# EasyEDA schematic SCH_TFG.json

## Sheets
1 Buck: TITLE: Buck; REV: 1.0; Date: 2022-05-14; Sheet: 1/1; Drawn By: H. Bohe Navarrete; Company: EUSS
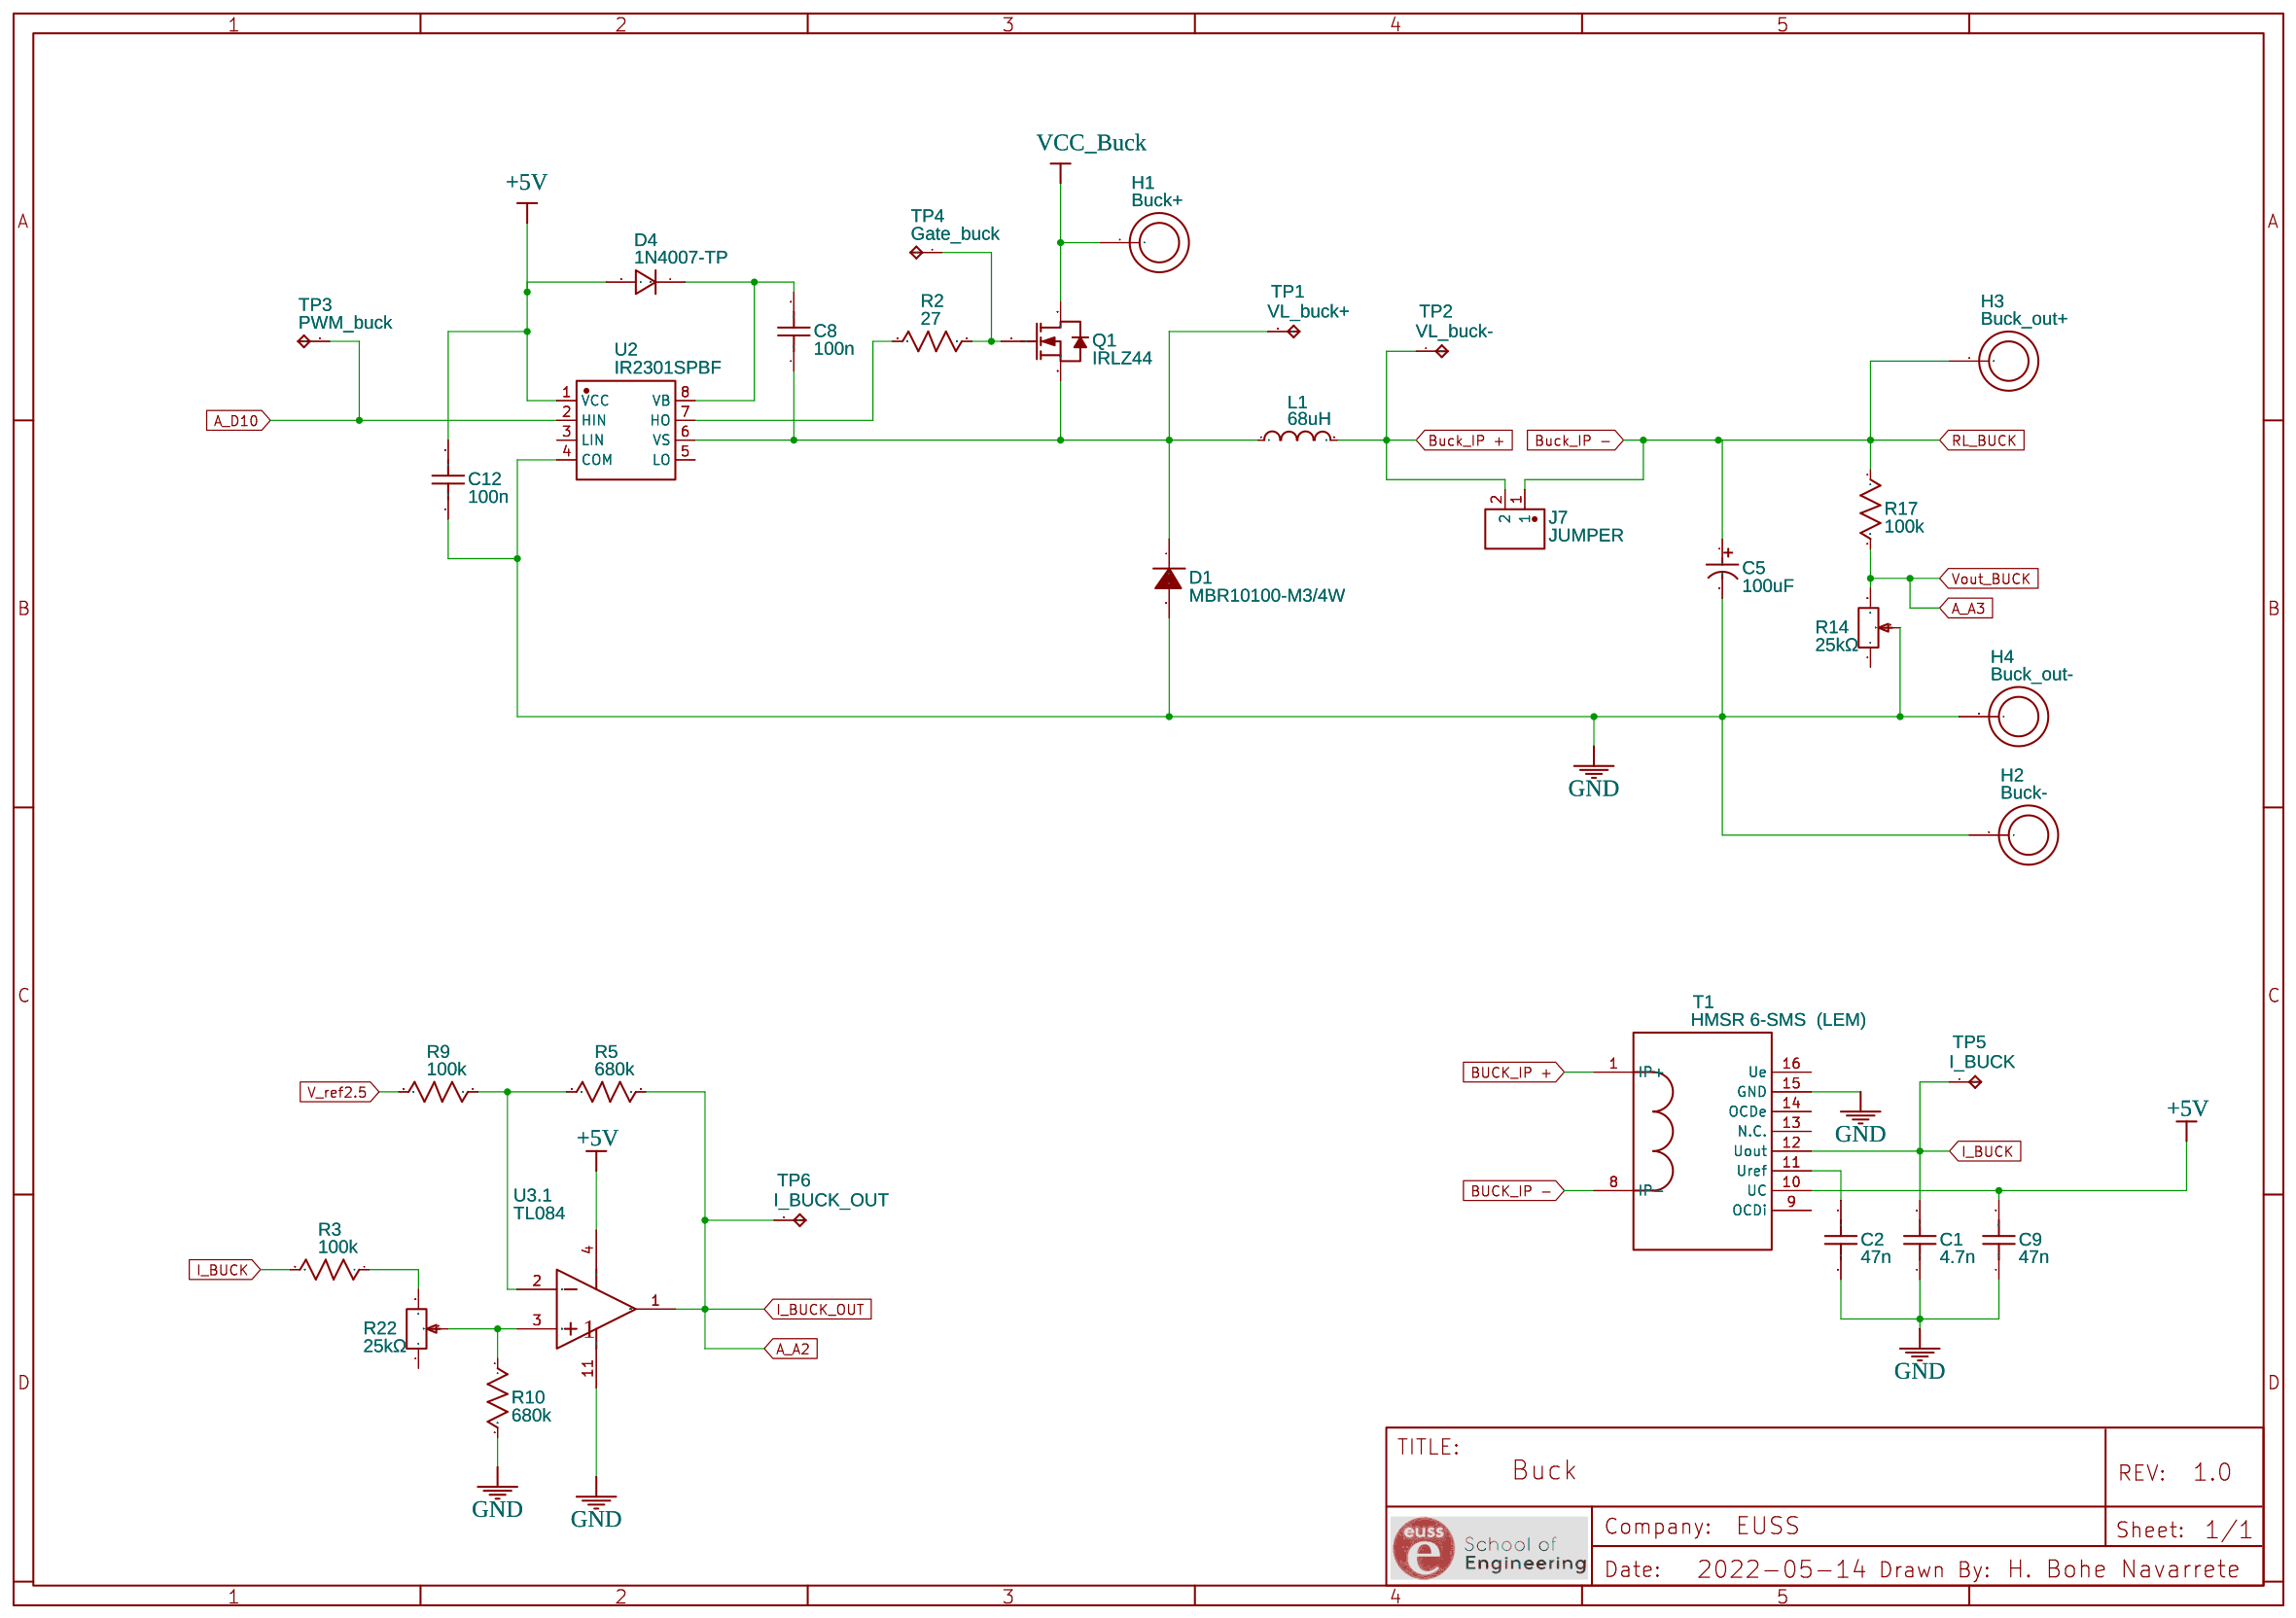
[diagram p0: Buck]
2 Boost copy: TITLE: Boost
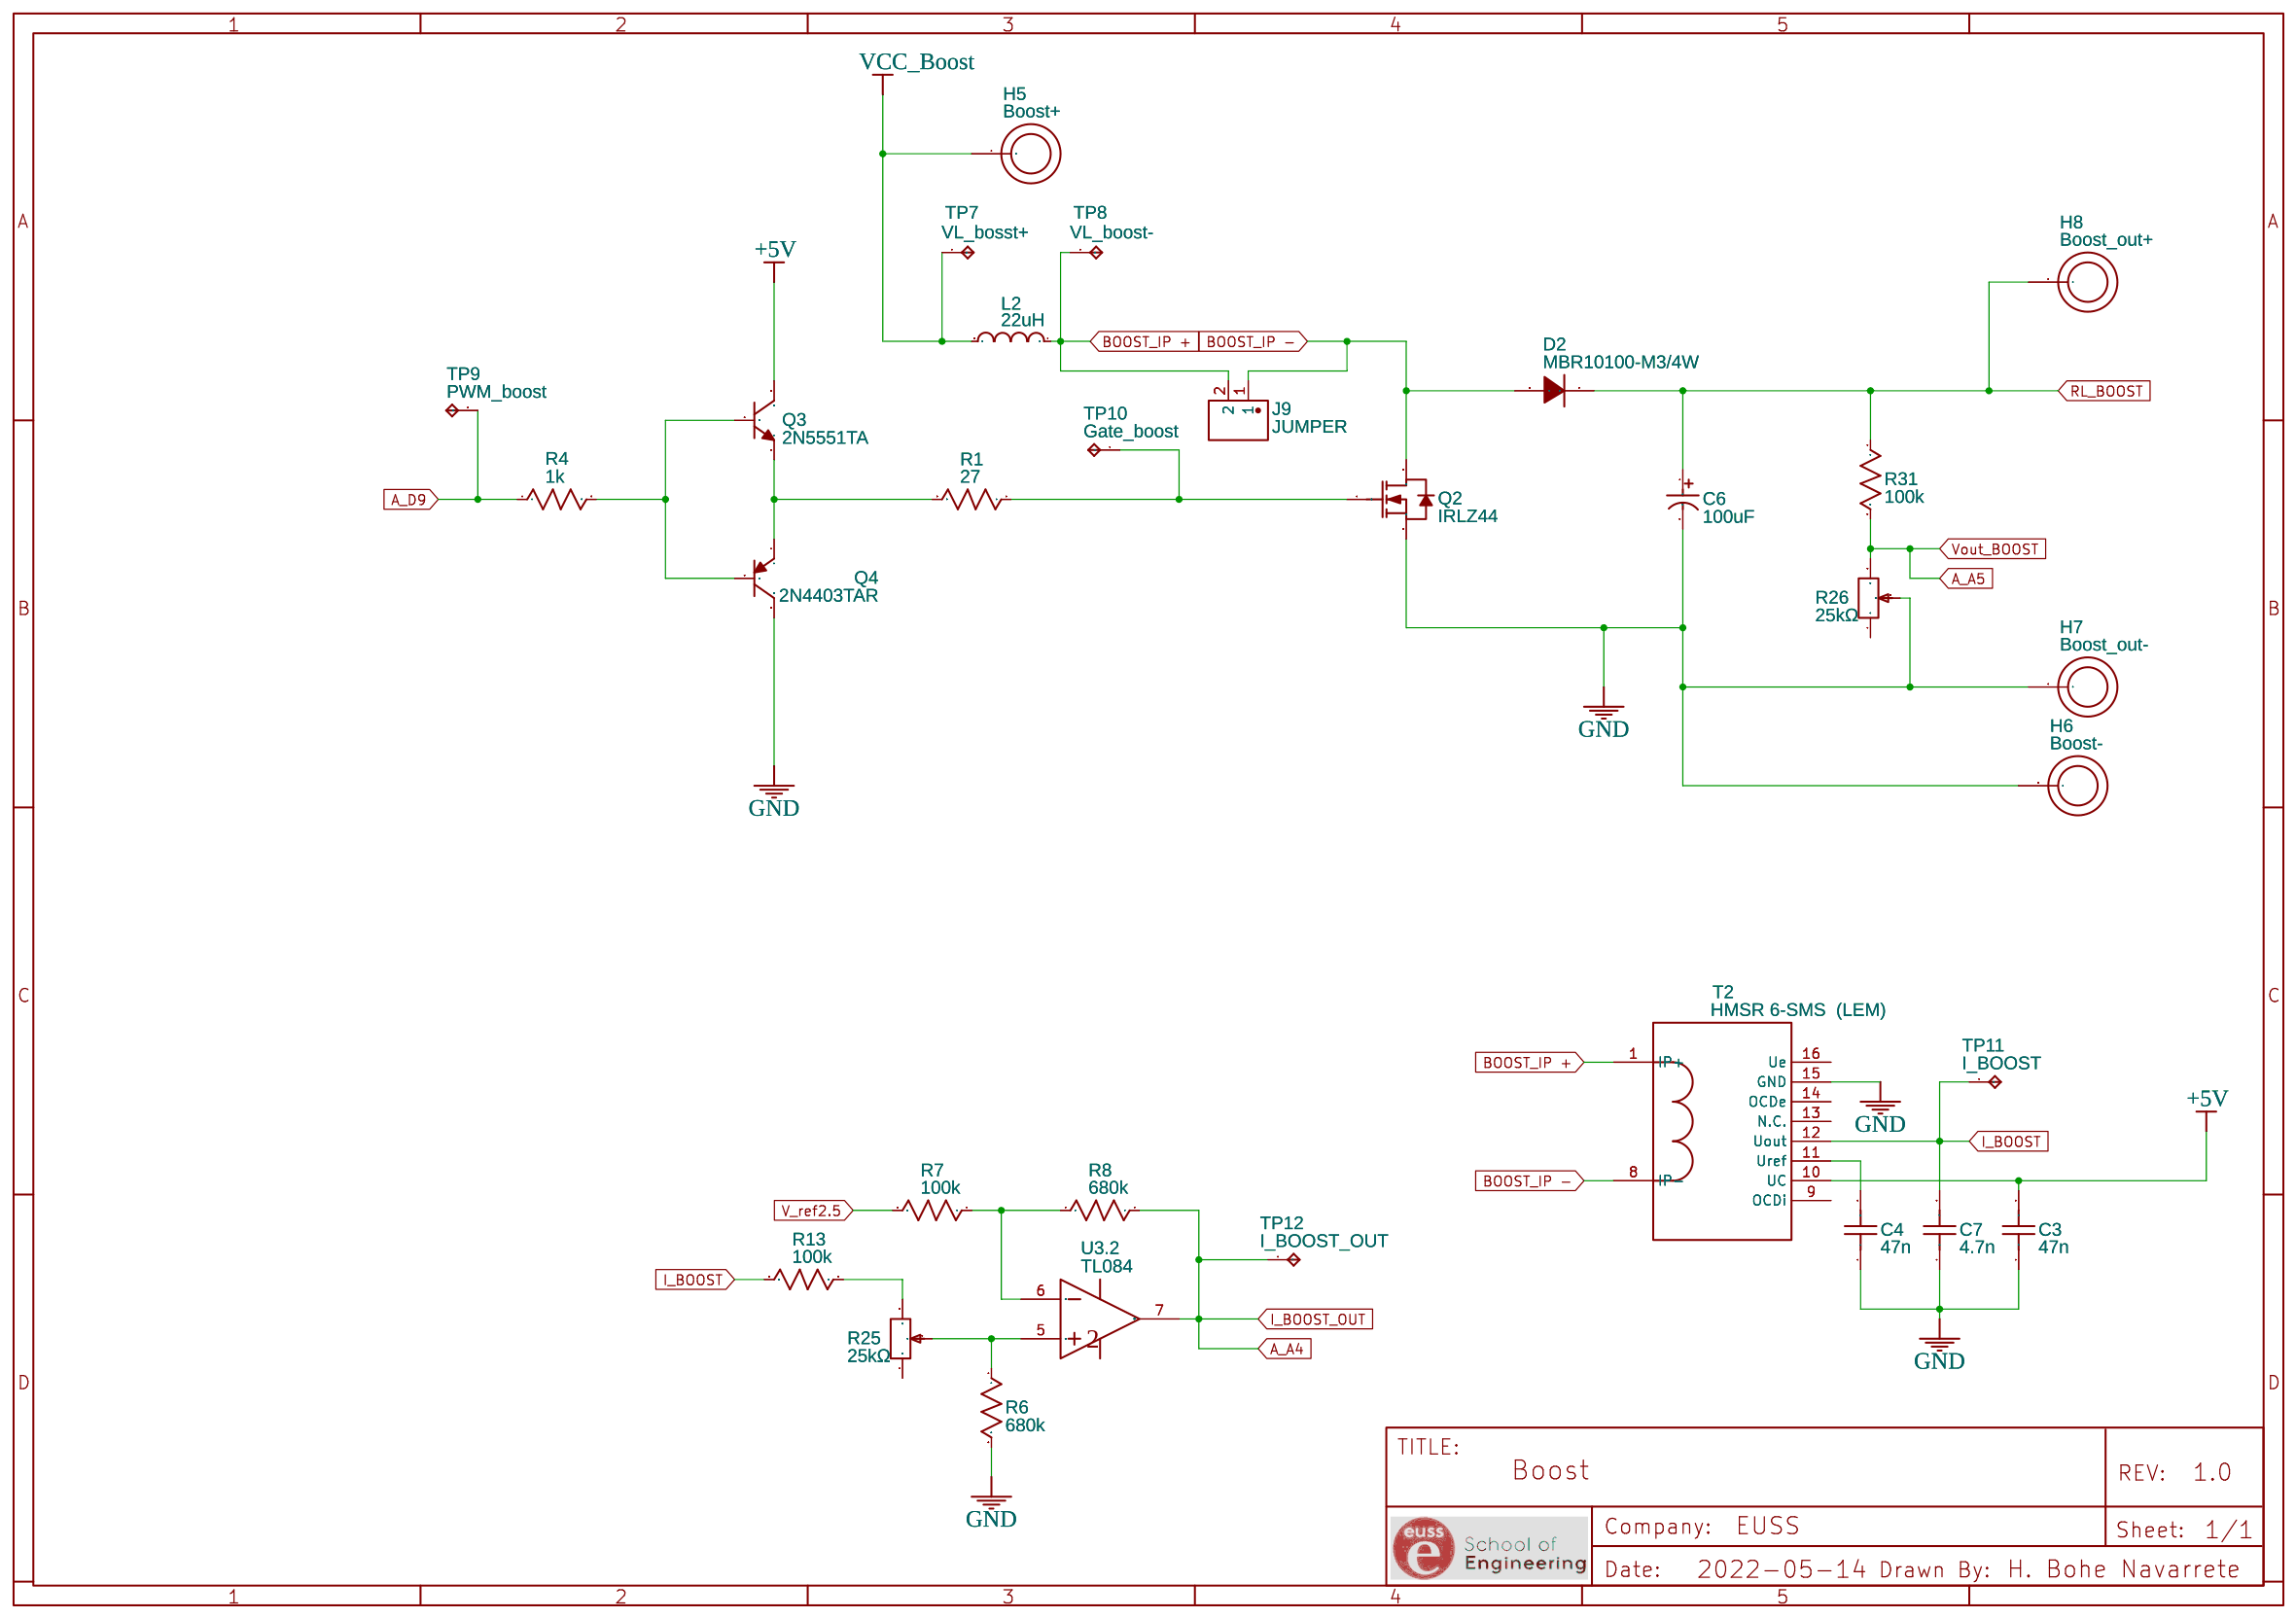
[diagram p1: Boost copy]
3 Arduino copy: TITLE: ARDUINO
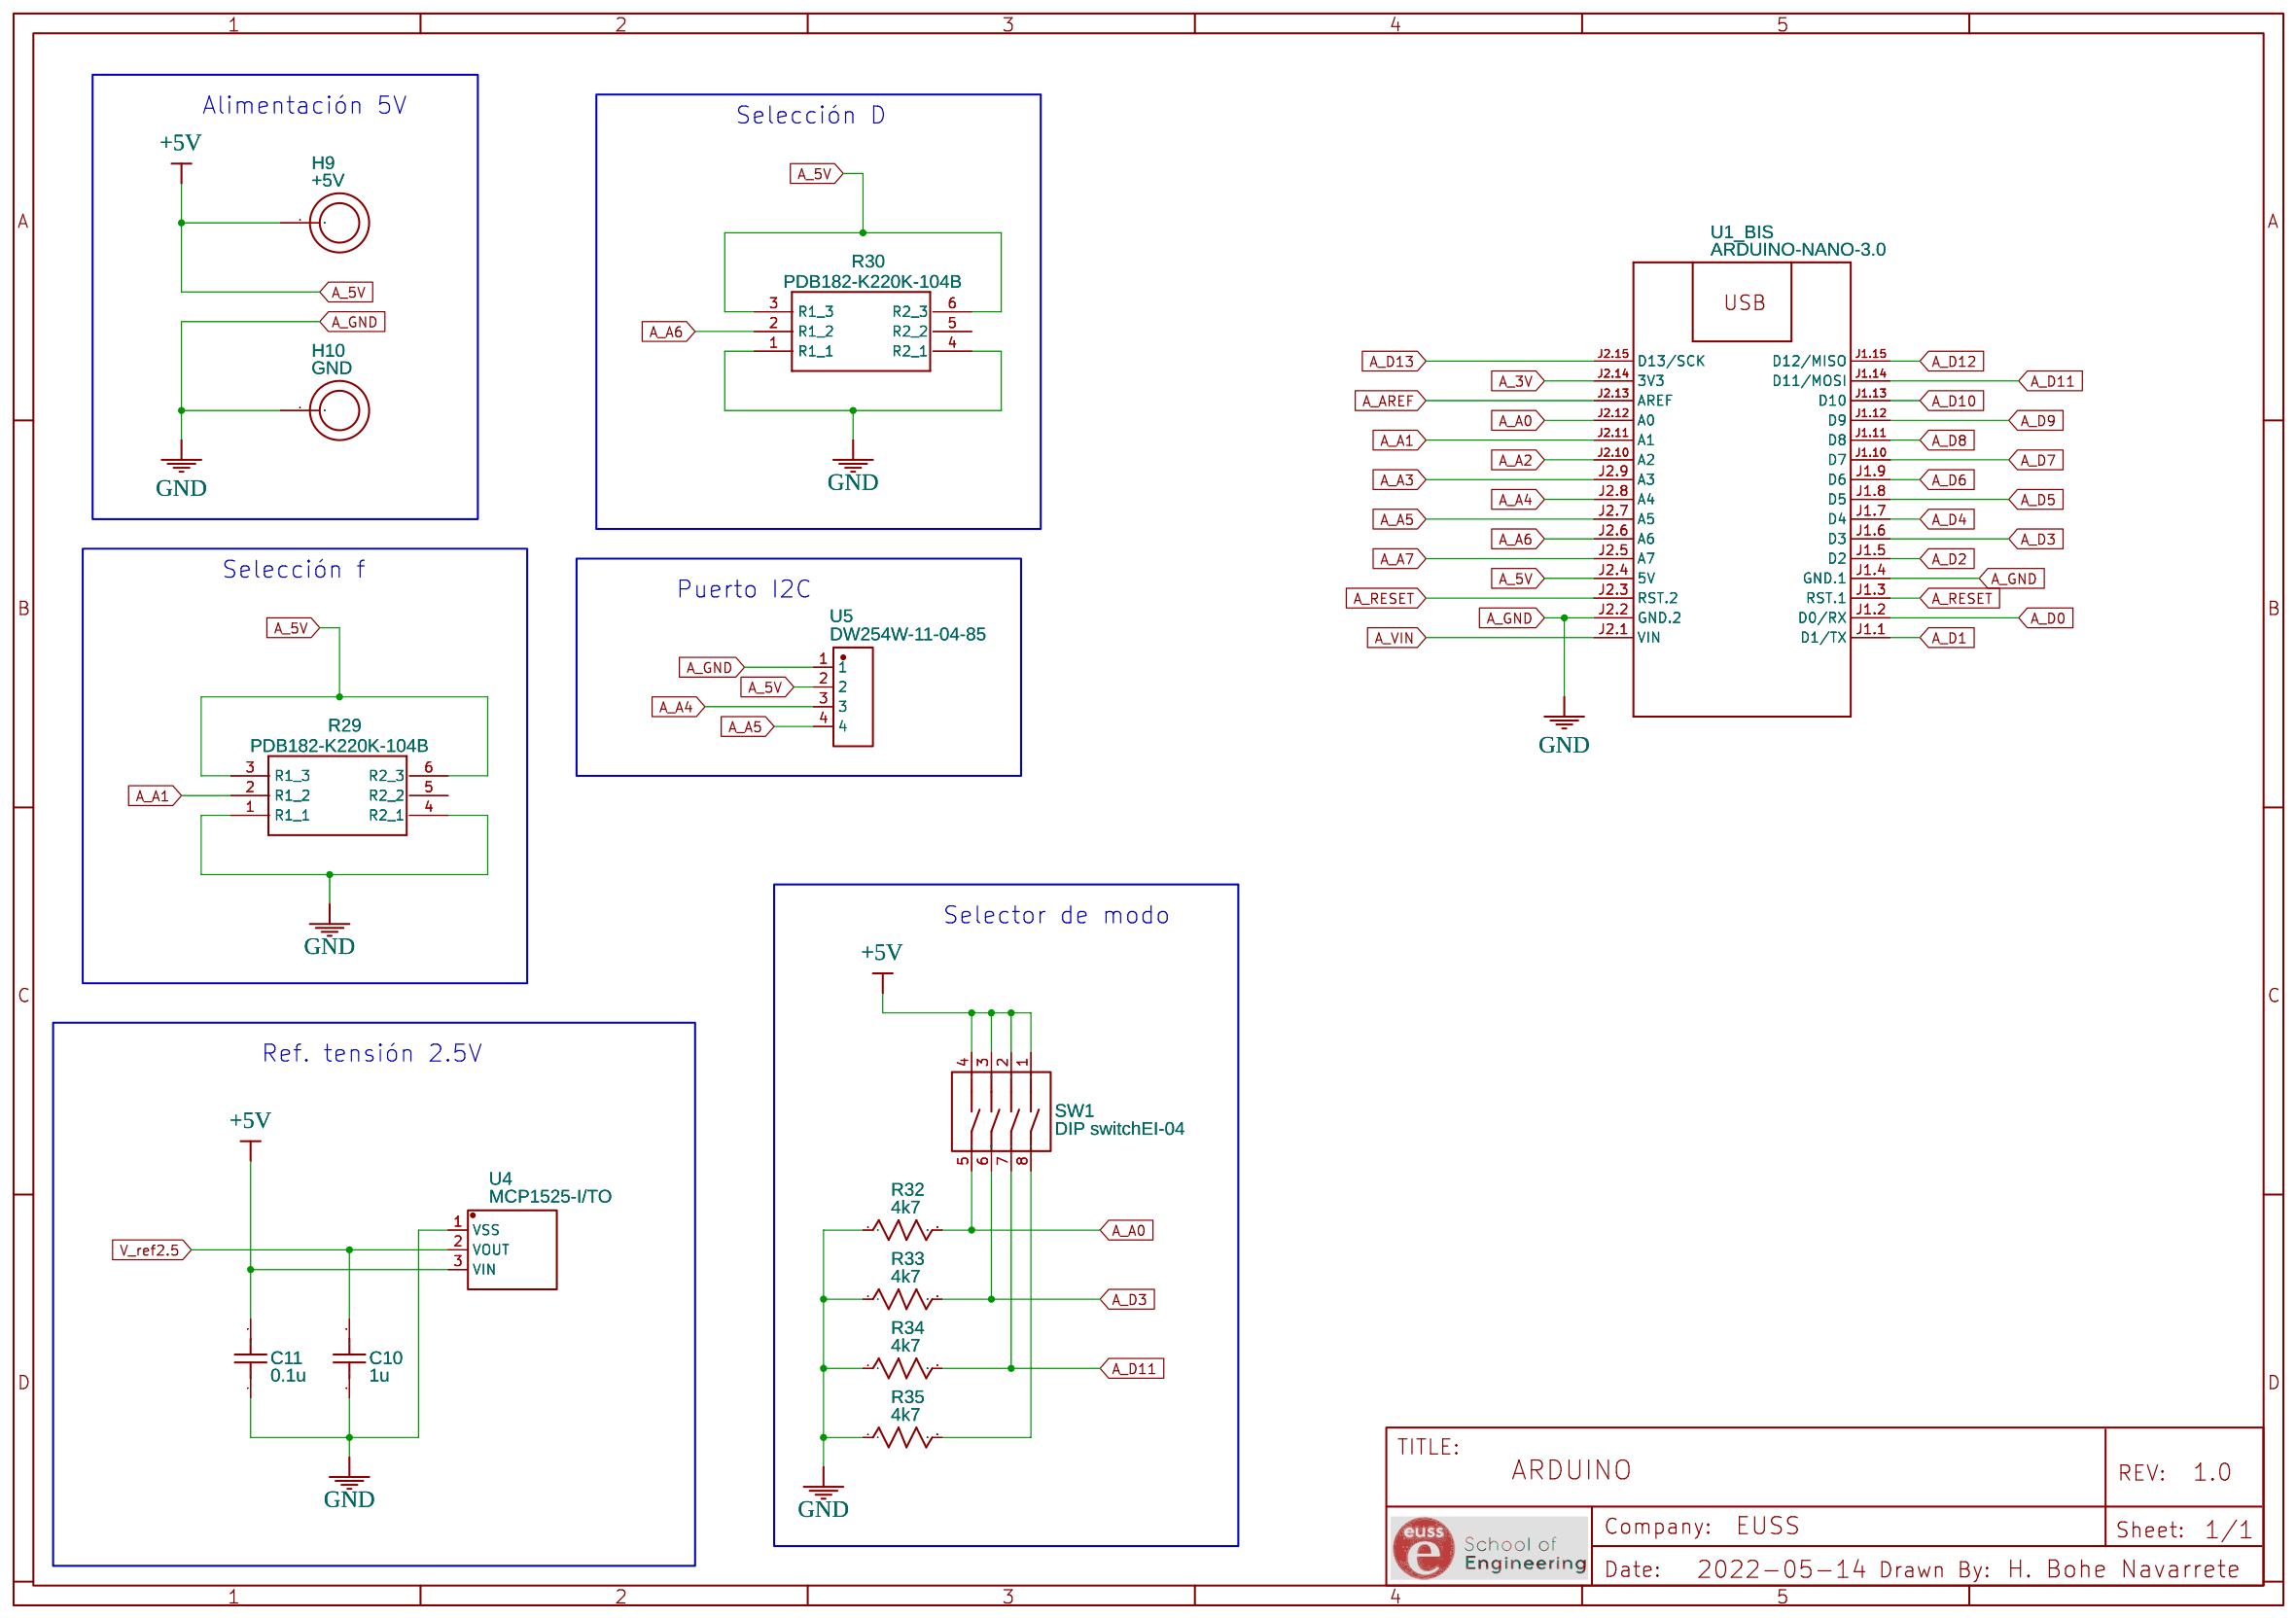
[diagram p2: Arduino copy]
4 Resitencias copy: TITLE: Resistencias
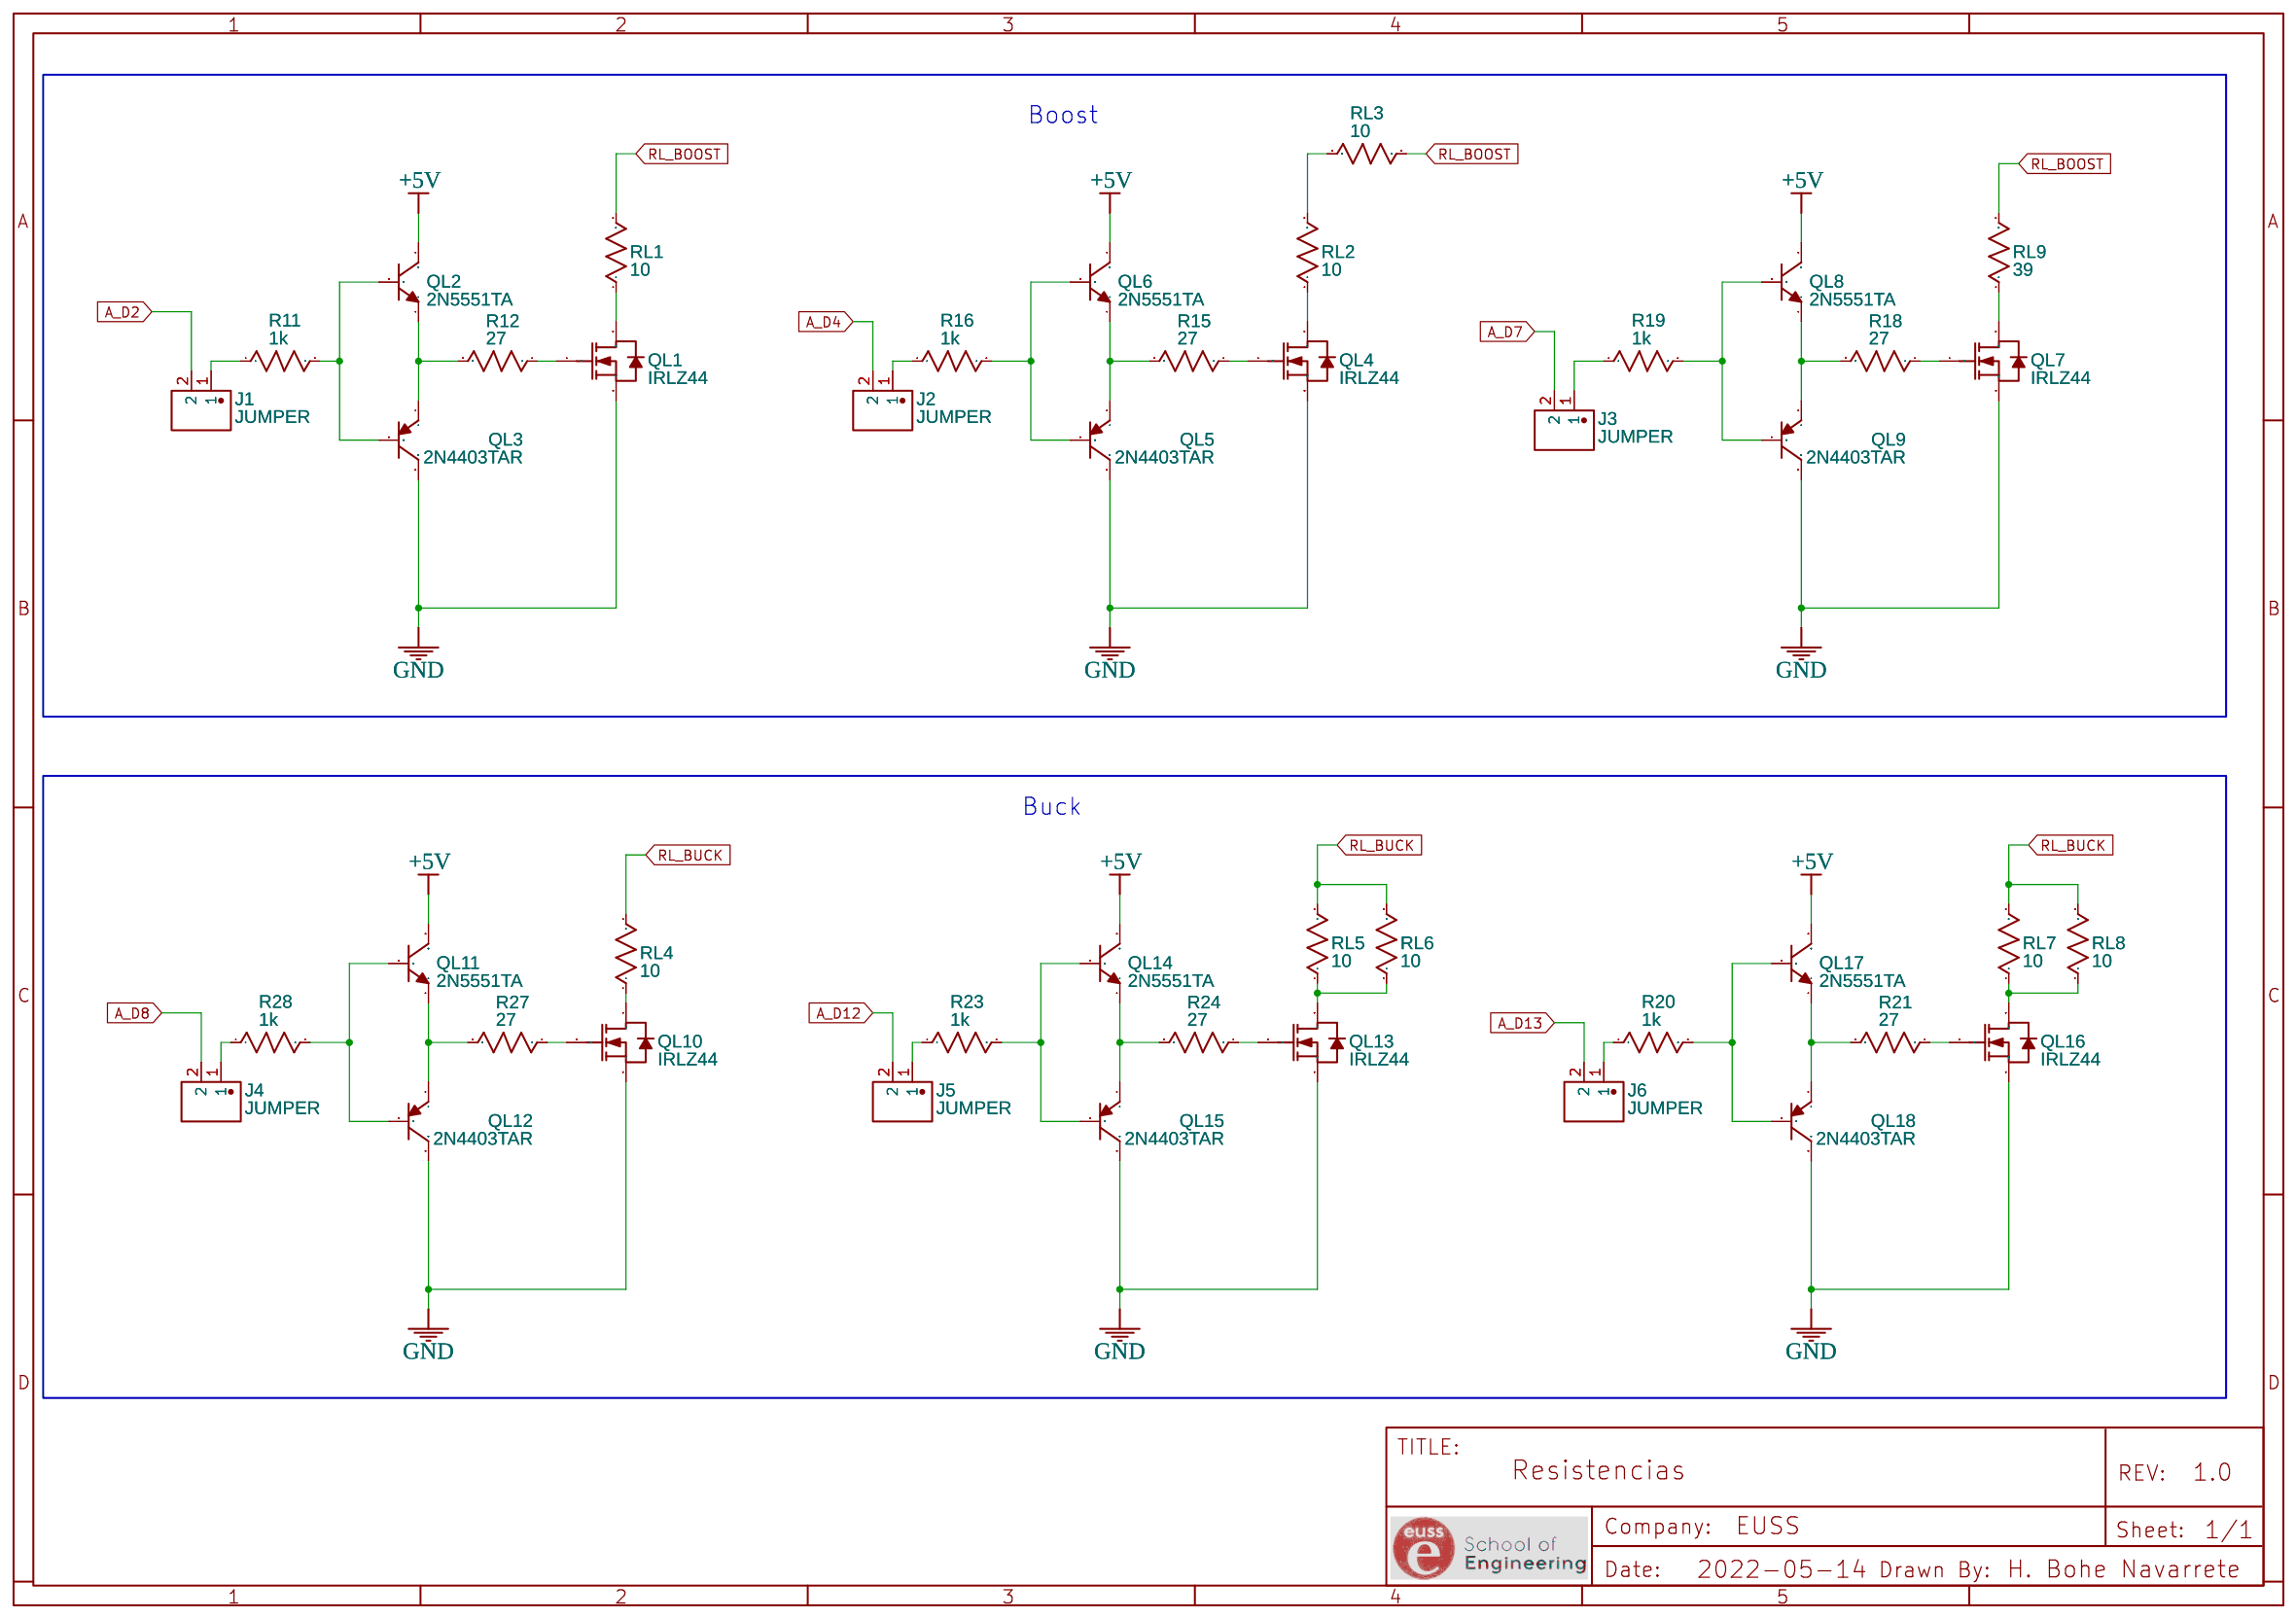
[diagram p3: Resitencias copy]
5 Sheet_1 copy: TITLE: Sheet_1; Date: 2022-06-09; Drawn By: Hector Bohe Navarrete; Company: Your Company
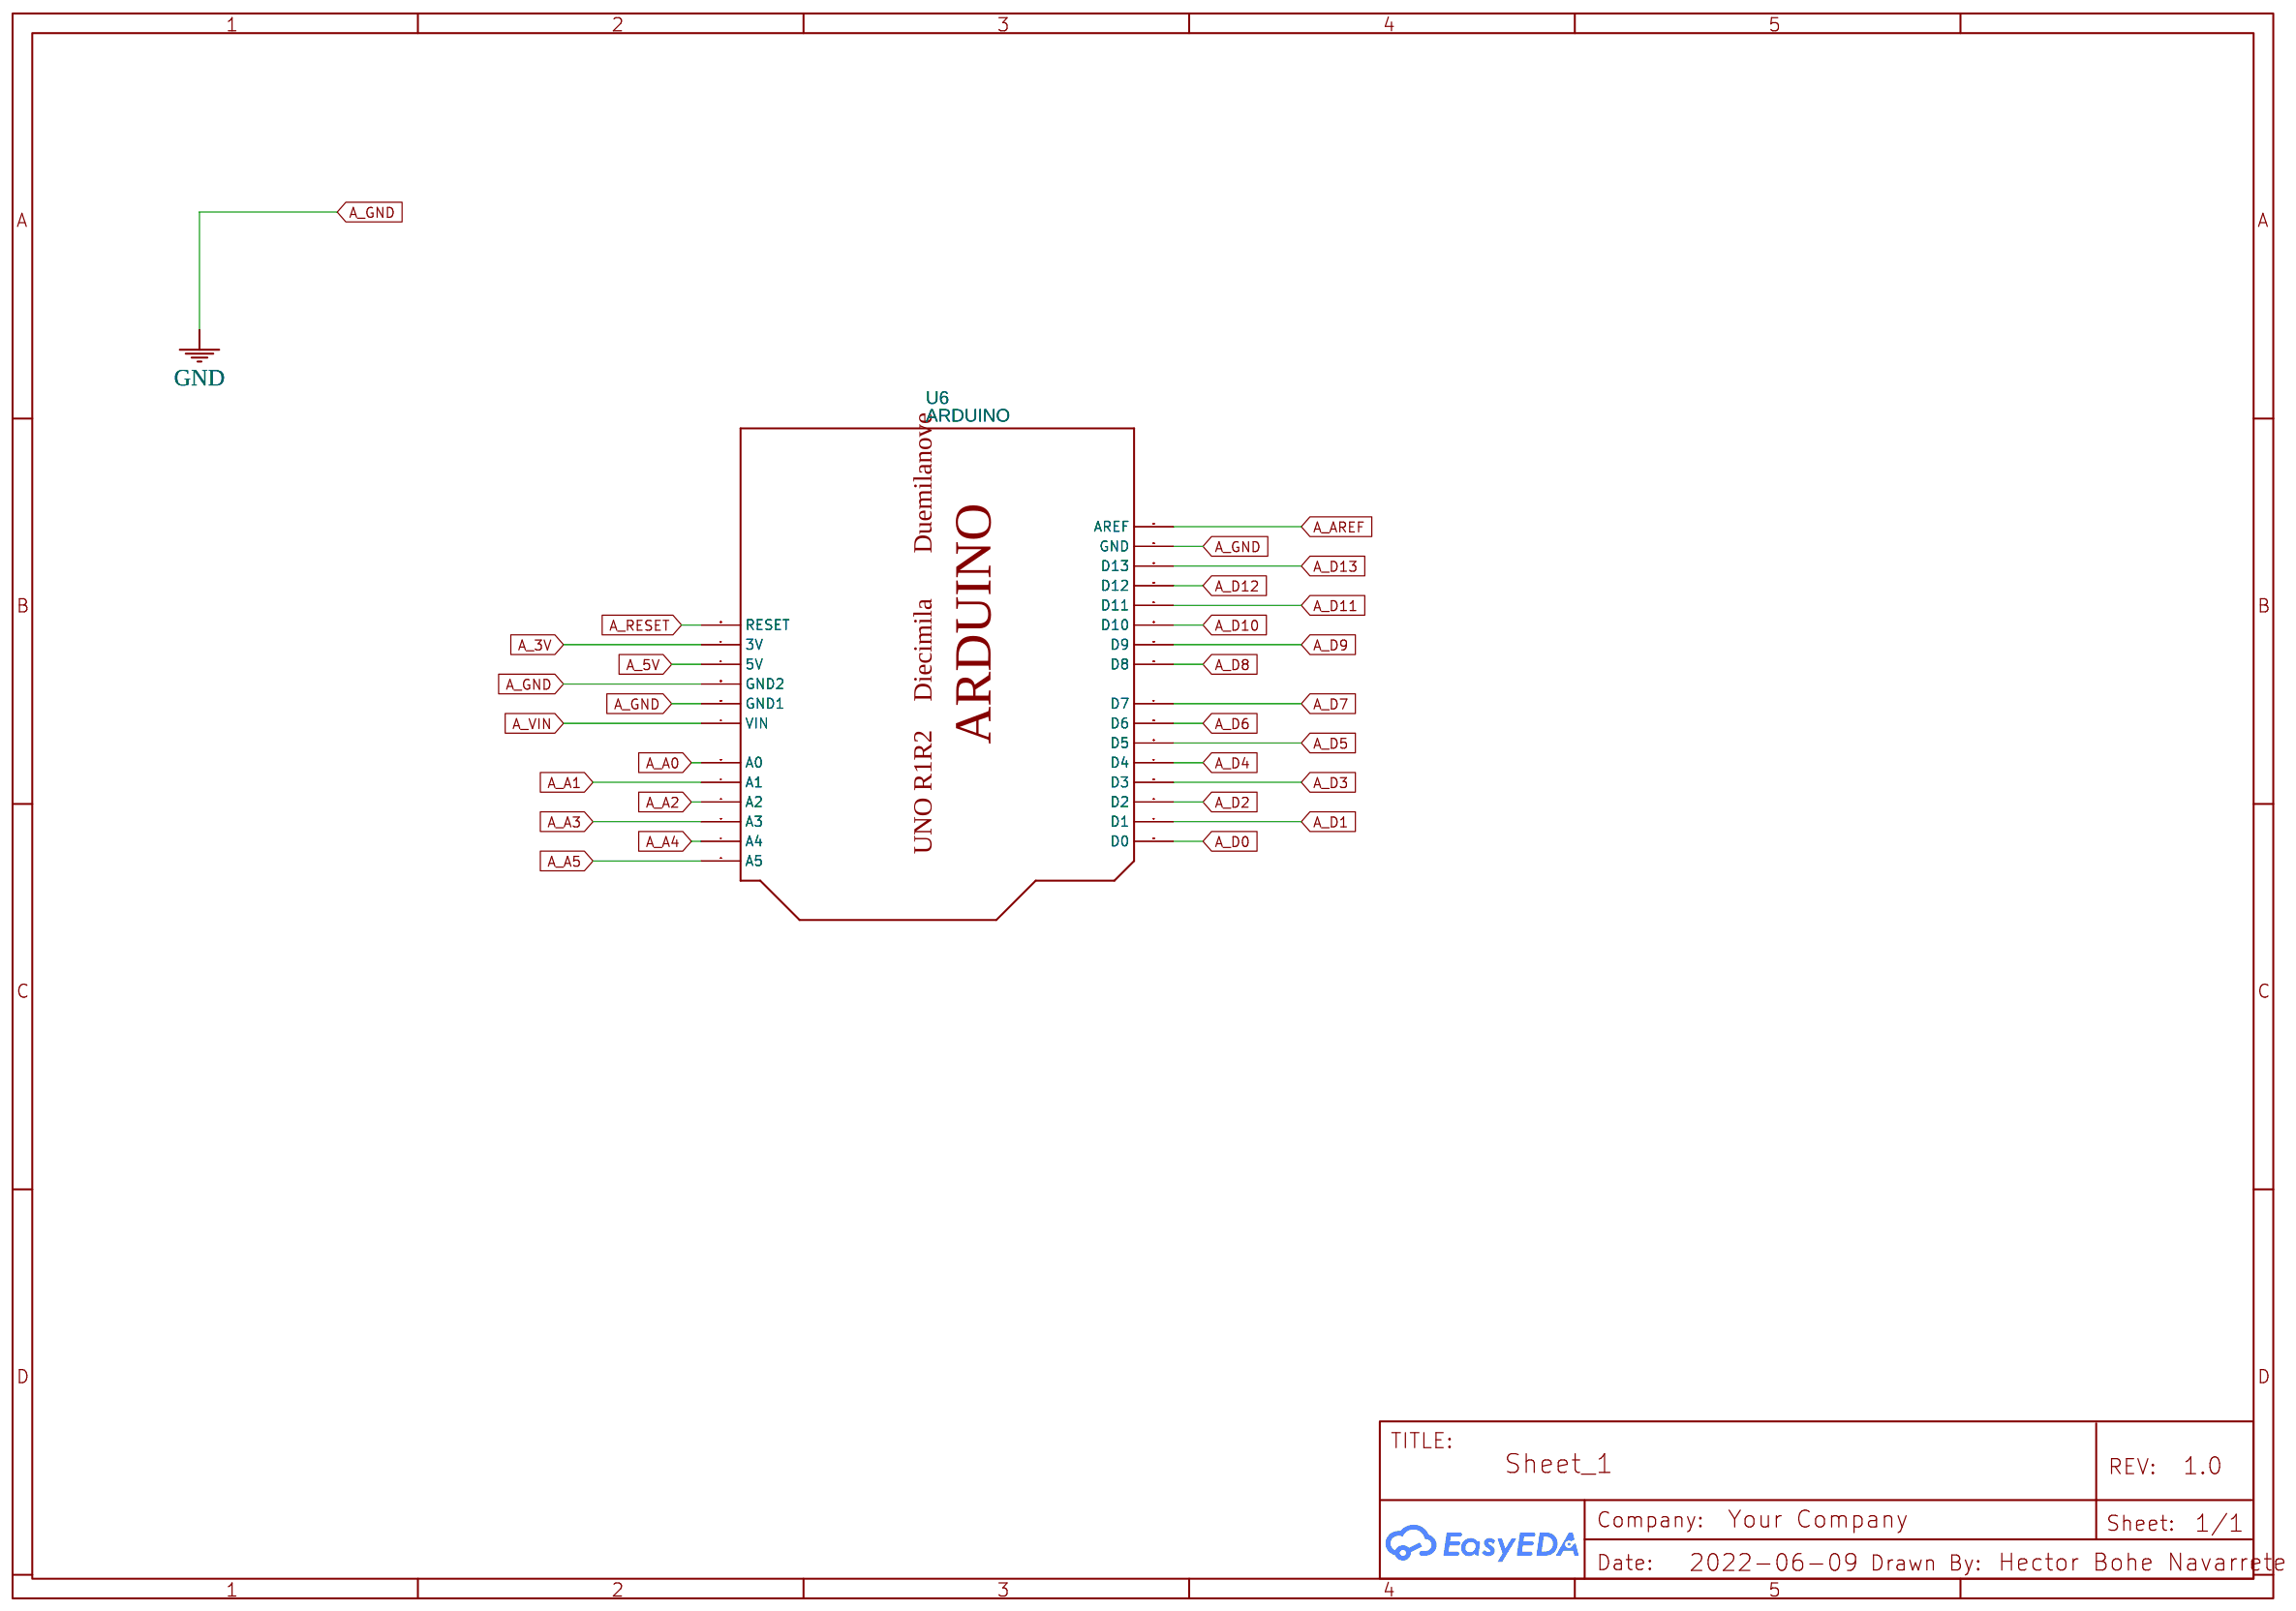
[diagram p4: Sheet_1 copy]

## Parts
sheet Arduino copy
C10  1u  [TFG_CAP-7.2*2.5+SMD_0603+0805]
C11  0.1u  [TFG_CAP-7.2*2.5+SMD_0603+0805]
H9  +5V  [TFG_BANANA]
H10  GND  [TFG_BANANA]
R29  PDB182-K220K-104B  [TFG_POTENCIOMETRO]
R30  PDB182-K220K-104B  [TFG_POTENCIOMETRO]
R32  4k7  [TFG_R_AXIAL-0.6+SMD_0603]
R33  4k7  [TFG_R_AXIAL-0.6+SMD_0603]
R34  4k7  [TFG_R_AXIAL-0.6+SMD_0603]
R35  4k7  [TFG_R_AXIAL-0.6+SMD_0603]
SW1  DIP switchEI-04  [SW-TH_DIPSWITCHEI-04]
U1_BIS  ARDUINO-NANO-3.0  [ARDUINO-NANO-3.0]
U4  MCP1525-I/TO  [TO-92-3_L4.9-W3.7-P1.27-L]
U5  DW254W-11-04-85  [HDR-TH_4P-P2.54-H-F-W10.3-N]
sheet Boost copy
C3  47n  [TFG_CAP-7.2*2.5+SMD_0603+0805]
C4  47n  [TFG_CAP-7.2*2.5+SMD_0603+0805]
C6  100uF  [CAP-TH_BD10.0-P5.00-D1.0-FD]
C7  4.7n  [TFG_CAP-7.2*2.5+SMD_0603+0805]
D2  MBR10100-M3/4W  [TO-220AC-2_L10.0-W4.5-P5.08-T]
H5  Boost+  [TFG_BANANA]
H6  Boost-  [TFG_BANANA]
H7  Boost_out-  [TFG_BANANA]
H8  Boost_out+  [TFG_BANANA]
J9  JUMPER  [HDR-TH_2P-P2.54-V-M-1]
L2  22uH  [SRP1040VA]
Q2  IRLZ44  [TO-220-3_L10.0-W4.5-P2.54-L]
Q3  2N5551TA  [TO-92-3_L4.8-W3.7-P2.54-L]
Q4  2N4403TAR  [TO-92-3_L4.8-W3.7-P2.54-L]
R1  27  [TFG_R_AXIAL-0.6+SMD_0603]
R4  1k  [TFG_R_AXIAL-0.6+SMD_0603]
R6  680k  [TFG_R_AXIAL-0.6+SMD_0603]
R7  100k  [TFG_R_AXIAL-0.6+SMD_0603]
R8  680k  [TFG_R_AXIAL-0.6+SMD_0603]
R13  100k  [TFG_R_AXIAL-0.6+SMD_0603]
R25  25kΩ  [RES-ADJ-TH_3P-L9.5-W4.9-P2.50-L_3296W]
R26  25kΩ  [RES-ADJ-TH_3P-L9.5-W4.9-P2.50-L_3296W]
R31  100k  [TFG_R_AXIAL-0.6+SMD_0603]
T2  HMSR 6-SMS  (LEM)  [HMSR SERIES-SMS  (LEM)]
TP7  VL_bosst+  [CONN-TH_6037]
TP8  VL_boost-  [CONN-TH_6037]
TP9  PWM_boost  [CONN-TH_6037]
TP10  Gate_boost  [CONN-TH_6037]
TP11  I_BOOST  [CONN-TH_6037]
TP12  I_BOOST_OUT  [CONN-TH_6037]
sheet Buck
C1  4.7n  [TFG_CAP-7.2*2.5+SMD_0603+0805]
C2  47n  [TFG_CAP-7.2*2.5+SMD_0603+0805]
C5  100uF  [CAP-TH_BD10.0-P5.00-D1.0-FD]
C8  100n  [TFG_CAP-7.2*2.5+SMD_0603+0805]
C9  47n  [TFG_CAP-7.2*2.5+SMD_0603+0805]
C12  100n  [TFG_CAP-7.2*2.5+SMD_0603+0805]
D1  MBR10100-M3/4W  [TO-220AC-2_L10.0-W4.5-P5.08-T]
D4  1N4007-TP  [DO-41_BD2.4-L4.7-P8.70-D0.9-RD]
H1  Buck+  [TFG_BANANA]
H2  Buck-  [TFG_BANANA]
H3  Buck_out+  [TFG_BANANA]
H4  Buck_out-  [TFG_BANANA]
J7  JUMPER  [HDR-TH_2P-P2.54-V-M-1]
L1  68uH  [IHLP6767GZER100M8A]
Q1  IRLZ44  [TO-220-3_L10.0-W4.5-P2.54-L]
R2  27  [TFG_R_AXIAL-0.6+SMD_0603]
R3  100k  [TFG_R_AXIAL-0.6+SMD_0603]
R5  680k  [TFG_R_AXIAL-0.6+SMD_0603]
R9  100k  [TFG_R_AXIAL-0.6+SMD_0603]
R10  680k  [TFG_R_AXIAL-0.6+SMD_0603]
R14  25kΩ  [RES-ADJ-TH_3P-L9.5-W4.9-P2.50-L_3296W]
R17  100k  [TFG_R_AXIAL-0.6+SMD_0603]
R22  25kΩ  [RES-ADJ-TH_3P-L9.5-W4.9-P2.50-L_3296W]
T1  HMSR 6-SMS  (LEM)  [HMSR SERIES-SMS  (LEM)]
TP1  VL_buck+  [CONN-TH_6037]
TP2  VL_buck-  [CONN-TH_6037]
TP3  PWM_buck  [CONN-TH_6037]
TP4  Gate_buck  [CONN-TH_6037]
TP5  I_BUCK  [CONN-TH_6037]
TP6  I_BUCK_OUT  [CONN-TH_6037]
U2  IR2301SPBF  [TEST_SOIC8]
U3  TL084  [PDIP-14_L19.7-W6.6-P2.54-LS8.3-BL]  (sections 1,2)
sheet Resitencias copy
J1  JUMPER  [HDR-TH_2P-P2.54-V-M-1]
J2  JUMPER  [HDR-TH_2P-P2.54-V-M-1]
J3  JUMPER  [HDR-TH_2P-P2.54-V-M-1]
J4  JUMPER  [HDR-TH_2P-P2.54-V-M-1]
J5  JUMPER  [HDR-TH_2P-P2.54-V-M-1]
J6  JUMPER  [HDR-TH_2P-P2.54-V-M-1]
QL1  IRLZ44  [TO-220-3_L10.0-W4.5-P2.54-L]
QL2  2N5551TA  [TO-92-3_L4.8-W3.7-P2.54-L]
QL3  2N4403TAR  [TO-92-3_L4.8-W3.7-P2.54-L]
QL4  IRLZ44  [TO-220-3_L10.0-W4.5-P2.54-L]
QL5  2N4403TAR  [TO-92-3_L4.8-W3.7-P2.54-L]
QL6  2N5551TA  [TO-92-3_L4.8-W3.7-P2.54-L]
QL7  IRLZ44  [TO-220-3_L10.0-W4.5-P2.54-L]
QL8  2N5551TA  [TO-92-3_L4.8-W3.7-P2.54-L]
QL9  2N4403TAR  [TO-92-3_L4.8-W3.7-P2.54-L]
QL10  IRLZ44  [TO-220-3_L10.0-W4.5-P2.54-L]
QL11  2N5551TA  [TO-92-3_L4.8-W3.7-P2.54-L]
QL12  2N4403TAR  [TO-92-3_L4.8-W3.7-P2.54-L]
QL13  IRLZ44  [TO-220-3_L10.0-W4.5-P2.54-L]
QL14  2N5551TA  [TO-92-3_L4.8-W3.7-P2.54-L]
QL15  2N4403TAR  [TO-92-3_L4.8-W3.7-P2.54-L]
QL16  IRLZ44  [TO-220-3_L10.0-W4.5-P2.54-L]
QL17  2N5551TA  [TO-92-3_L4.8-W3.7-P2.54-L]
QL18  2N4403TAR  [TO-92-3_L4.8-W3.7-P2.54-L]
R11  1k  [TFG_R_AXIAL-0.6+SMD_0603]
R12  27  [TFG_R_AXIAL-0.6+SMD_0603]
R15  27  [TFG_R_AXIAL-0.6+SMD_0603]
R16  1k  [TFG_R_AXIAL-0.6+SMD_0603]
R18  27  [TFG_R_AXIAL-0.6+SMD_0603]
R19  1k  [TFG_R_AXIAL-0.6+SMD_0603]
R20  1k  [TFG_R_AXIAL-0.6+SMD_0603]
R21  27  [TFG_R_AXIAL-0.6+SMD_0603]
R23  1k  [TFG_R_AXIAL-0.6+SMD_0603]
R24  27  [TFG_R_AXIAL-0.6+SMD_0603]
R27  27  [TFG_R_AXIAL-0.6+SMD_0603]
R28  1k  [TFG_R_AXIAL-0.6+SMD_0603]
RL1  10  [SQMW10S]
RL2  10  [SQMW10S]
RL3  10  [SQMW10S]
RL4  10  [SQMW10S]
RL5  10  [SQMW10S]
RL6  10  [SQMW10S]
RL7  10  [SQMW10S]
RL8  10  [SQMW10S]
RL9  39  [SQMW10S]
sheet Sheet_1 copy
U6  ARDUINO  [ARDUINO-NODIM]

## Library data of the parts
C1-C4 C7-C12 = C_0603_US: Contributor: LCEDA_Lib
H1-H10 = 4mm banana connector: Contributor: porcinus
R29 R30 = PDB182-K220K-104B: Contributor: kmhatch11
R2 R32-R35 RL1-RL9 = R_AXIAL-0.6_US: Contributor: LCEDA_Lib
SW1 = DIP switchEI-04: Supplier: LCSC; Manufacturer: DIP; Supplier Part: C99987; JLCPCB Part Class: Extended Part
U1_BIS = ARDUINO-NANO-3.0: Contributor: Colton Hillebrand
U4 = MCP1525-I/TO: Supplier: LCSC; Supplier Part: C184389; Manufacturer: Microchip Tech; Contributor: LCSC; JLCPCB Part Class: Extended Part
U5 = DW254W-11-04-85: Supplier: LCSC; Supplier Part: C2935994; Manufacturer: DEALON(德艺隆); Contributor: LCSC
C5 C6 = 10X17 100V100uf: Supplier: LCSC; Manufacturer: ValuePro; Supplier Part: C3336; JLCPCB Part Class: Extended Part
D1 D2 = MBR10100-M3/4W: Supplier: LCSC; Supplier Part: C232402; Manufacturer: ON Semicon; Manufacturer Part: MBR1090G; Contributor: LCSC; JLCPCB Part Class: Extended Part
J1-J7 J9 = JUMPER2: Supplier: LCSC; Supplier Part: C2940092; Manufacturer: null; Manufacturer Part: Jumper2; Contributor: LCSC; JLCPCB Part Class: Extended Part
L2 = SRP1040VA Inductor 68uH: Supplier: Digi-Key; Manufacturer: Bourns Inc.; Manufacturer Part: SRP1040VA-680M; Supplier Part: SRP1040VA-680M; link: https://www.digikey.com/product-detail/en/bourns-inc/SRP1040VA-680M/118-SRP1040VA-680MTR-ND/11656179; Contributor: Kirk Spencer
Q1 Q2 QL1 QL4 QL7 QL10 QL13 QL16 = IRLZ44NPBF: Supplier: LCSC; Manufacturer: IR; Supplier Part: C38774; JLCPCB Part Class: Extended Part
Q3 QL2 QL6 QL8 QL11 QL14 QL17 = 2N5551TA: Supplier: LCSC; Supplier Part: C900712; Manufacturer: onsemi(安森美); Contributor: LCSC; JLCPCB Part Class: Extended Part
Q4 QL3 QL5 QL9 QL12 QL15 QL18 = 2N4403TAR: Supplier: LCSC; Supplier Part: C900707; Manufacturer: onsemi(安森美); Contributor: LCSC; JLCPCB Part Class: Extended Part
R1 R3-R13 R15-R21 R23 R24 R27 R28 R31 = R_0603_US: Contributor: LCEDA_Lib
R14 R22 R25 R26 = 3296W-1-253LF: Supplier: LCSC; Manufacturer: BOURNS; Supplier Part: C55264; Resistance(Ohms): 25K; Resistance (Ohms): 25K; JLCPCB Part Class: Extended Part
T1 T2 = HMSR 6-SMS  (LEM): Manufacturer Part: 0954CLEM02; Contributor: MasterBdf
TP1-TP12 = 6037: Supplier: LCSC; Supplier Part: C238145; Manufacturer: Keystone; Contributor: LCSC; JLCPCB Part Class: Extended Part
D4 = 1N4007-TP: Supplier: LCSC; Supplier Part: C78736; Manufacturer: Micro Commercial Components; Contributor: LCSC; JLCPCB Part Class: Extended Part
L1 = General Inductor(TH)/10uH: Supplier: LCSC; Manufacturer: ReliaPro; Manufacturer Part: General Inductor(TH)/10uH电感; Supplier Part: C27938; JLCPCB Part Class: Extended Part
U2 = IR2301SPBF: Supplier: LCSC; Supplier Part: C537624; Manufacturer: Infineon Technologies; Contributor: LCSC; JLCPCB Part Class: Extended Part
U3 = LM324NG: Supplier Part: C99121; Supplier: LCSC; Manufacturer Part: ON; subpart_no: 1
U6 = ARDUINO: Contributor: Adafruit

## Nets
+5V: C3.2 C9.2 C11.2 C12.2 D4.2(A) H9.1 Q3.3(C) QL2.3(C) QL6.3(C) QL8.3(C) QL11.3(C) QL14.3(C) QL17.3(C) R29.3(R1) R29.6(R2_3) R30.3(R1) R30.6(R2_3) SW1.1 SW1.2 SW1.3 SW1.4 T1.10(UC) T2.10(UC) U1_BIS.J2.4(5V) U2.1(VCC) U3.4(VCC) U4.3(VIN) U5.2 U6.5V
VCC_Boost: H5.1 L2.6(1) TP7.1
VCC_Buck: H1.1 Q1.2(D)
A_3V: U1_BIS.J2.14(3V3) U6.3V
A_A0: R32.2 SW1.5 U1_BIS.J2.12(A0) U6.A0
A_A1: R29.2(R1) U1_BIS.J2.11(A1) U6.A1
A_A2: R5.1 TP6.1 U1_BIS.J2.10(A2) U3.1(OUT1) U6.A2
A_A3: R14.3 R17.2 U1_BIS.J2.9(A3) U6.A3
A_A4: R8.1 TP12.1 U1_BIS.J2.8(A4) U3.7(OUT2) U5.3 U6.A4
A_A5: R26.3 R31.2 U1_BIS.J2.7(A5) U5.4 U6.A5
A_A6: R30.2(R1) U1_BIS.J2.6(A6)
A_A7: U1_BIS.J2.5(A7)
A_AREF: U1_BIS.J2.13(AREF) U6.AREF
A_D0: U1_BIS.J1.2(D0/RX) U6.D0
A_D1: U1_BIS.J1.1(D1/TX) U6.D1
A_D2: J1.2 U1_BIS.J1.5(D2) U6.D2
A_D3: R33.2 SW1.6 U1_BIS.J1.6(D3) U6.D3
A_D4: J2.2 U1_BIS.J1.7(D4) U6.D4
A_D5: U1_BIS.J1.8(D5) U6.D5
A_D6: U1_BIS.J1.9(D6) U6.D6
A_D7: J3.2 U1_BIS.J1.10(D7) U6.D7
A_D8: J4.2 U1_BIS.J1.11(D8) U6.D8
A_D9: R4.1 TP9.1 U1_BIS.J1.12(D9) U6.D9
A_D10: TP3.1 U1_BIS.J1.13(D10) U2.2(HIN) U6.D10
A_D11: R34.2 SW1.7 U1_BIS.J1.14(D11/MOSI) U6.D11
A_D12: J5.2 U1_BIS.J1.15(D12/MISO) U6.D12
A_D13: J6.2 U1_BIS.J2.15(D13/SCK) U6.D13
A_GND: C1.1 C2.2 C3.1 C4.1 C5.2 C6.2 C7.1 C9.1 C10.1 C11.1 C12.1 D1.3(A) H2.1 H4.1 H6.1 H7.1 H10.1 Q2.3(S) Q4.3(C) QL1.3(S) QL3.3(C) QL4.3(S) QL5.3(C) QL7.3(S) QL9.3(C) QL10.3(S) QL12.3(C) QL13.3(S) QL15.3(C) QL16.3(S) QL18.3(C) R6.2 R10.2 R14.2 R26.2 R29.1(R1) R29.4(R2_1) R30.1(R1) R30.4(R2_1) R32.1 R33.1 R34.1 R35.1 T1.15(GND) T2.15(GND) U1_BIS.J1.4(GND.1) U1_BIS.J2.2(GND.2) U2.4(COM) U3.11(GND) U4.1(VSS) U5.1 U6.GND U6.GND1 U6.GND2
A_RESET: U1_BIS.J1.3(RST.1) U1_BIS.J2.3(RST.2) U6.RESET
A_VIN: U1_BIS.J2.1(VIN) U6.VIN
BOOST_IP +: J9.2 L2.7(2) T2.1(IP+) TP8.1
BOOST_IP -: D2.3(A) J9.1 Q2.2(D) T2.8(IP-)
Buck_IP +: J7.2 L1.2 TP2.1
BUCK_IP +: T1.1(IP+)
Buck_IP -: C5.1 H3.1 J7.1 R17.1 RL4.2 RL5.2 RL6.2 RL7.2 RL8.2
BUCK_IP -: T1.8(IP-)
I_BOOST: C7.2 R13.2 T2.12(Uout) TP11.1
I_BUCK: C1.2 R3.2 T1.12(Uout) TP5.1
RL_BOOST: C6.1 D2.1(C) H8.1 R31.1 RL1.2 RL3.1 RL9.2
V_ref2.5: C10.2 R7.2 R9.2 U4.2(VOUT)
Net-(C2-1): C2.1 T1.11(Uref)
Net-(C4-2): C4.2 T2.11(Uref)
Net-(C8-1): C8.1 D1.1(C) L1.1 Q1.3(S) TP1.1 U2.6(VS)
Net-(C8-2): C8.2 D4.1(C) U2.8(VB)
Net-(J1-1): J1.1 R11.1
Net-(J2-1): J2.1 R16.1
Net-(J3-1): J3.1 R19.1
Net-(J4-1): J4.1 R28.1
Net-(J5-1): J5.1 R23.1
Net-(J6-1): J6.1 R20.1
Net-(Q1-1): Q1.1(G) R2.2 TP4.1
Net-(Q2-1): Q2.1(G) R1.1 TP10.1
Net-(Q3-1): Q3.1(E) Q4.1(E) R1.2
Net-(Q3-2): Q3.2(B) Q4.2(B) R4.2
Net-(QL1-1): QL1.1(G) R12.1
Net-(QL1-2): QL1.2(D) RL1.1
Net-(QL2-1): QL2.1(E) QL3.1(E) R12.2
Net-(QL2-2): QL2.2(B) QL3.2(B) R11.2
Net-(QL4-1): QL4.1(G) R15.1
Net-(QL4-2): QL4.2(D) RL2.1
Net-(QL5-1): QL5.1(E) QL6.1(E) R15.2
Net-(QL5-2): QL5.2(B) QL6.2(B) R16.2
Net-(QL7-1): QL7.1(G) R18.1
Net-(QL7-2): QL7.2(D) RL9.1
Net-(QL8-1): QL8.1(E) QL9.1(E) R18.2
Net-(QL8-2): QL8.2(B) QL9.2(B) R19.2
Net-(QL10-1): QL10.1(G) R27.1
Net-(QL10-2): QL10.2(D) RL4.1
Net-(QL11-1): QL11.1(E) QL12.1(E) R27.2
Net-(QL11-2): QL11.2(B) QL12.2(B) R28.2
Net-(QL13-1): QL13.1(G) R24.1
Net-(QL13-2): QL13.2(D) RL5.1 RL6.1
Net-(QL14-1): QL14.1(E) QL15.1(E) R24.2
Net-(QL14-2): QL14.2(B) QL15.2(B) R23.2
Net-(QL16-1): QL16.1(G) R21.1
Net-(QL16-2): QL16.2(D) RL7.1 RL8.1
Net-(QL17-1): QL17.1(E) QL18.1(E) R21.2
Net-(QL17-2): QL17.2(B) QL18.2(B) R20.2
Net-(R2-1): R2.1 U2.7(HO)
Net-(R3-1): R3.1 R22.3
Net-(R5-2): R5.2 R9.1 U3.2(IN1-)
Net-(R6-1): R6.1 R25.2 U3.5(IN2+)
Net-(R7-1): R7.1 R8.2 U3.6(IN2-)
Net-(R10-1): R10.1 R22.2 U3.3(IN1+)
Net-(R13-1): R13.1 R25.3
Net-(R35-2): R35.2 SW1.8
Net-(RL2-2): RL2.2 RL3.2

Not connected (* = marked no-connect by the designer): R14 1; R22 1; R25 1; R26 1; R29 5(R2_2); R30 5(R2_2); T1 9(OCDi) 13(N.C.) 14(OCDe) 16(Ue); T2 9(OCDi) 13(N.C.) 14(OCDe) 16(Ue); U2 3(LIN) 5(LO)

## Notes on the sheets
sheet 3
- Alimentación 5V
- Selección D
- Selección f
- Puerto I2C
- Selector de modo
- Ref. tensión 2.5V
sheet 4
- Boost
- Buck
